# EasyEDA schematic Induction_motor_control.json
TITLE: Sheet_1; REV: 1.0; Date: 2024-01-03; Sheet: 1/1; Company: Your Company
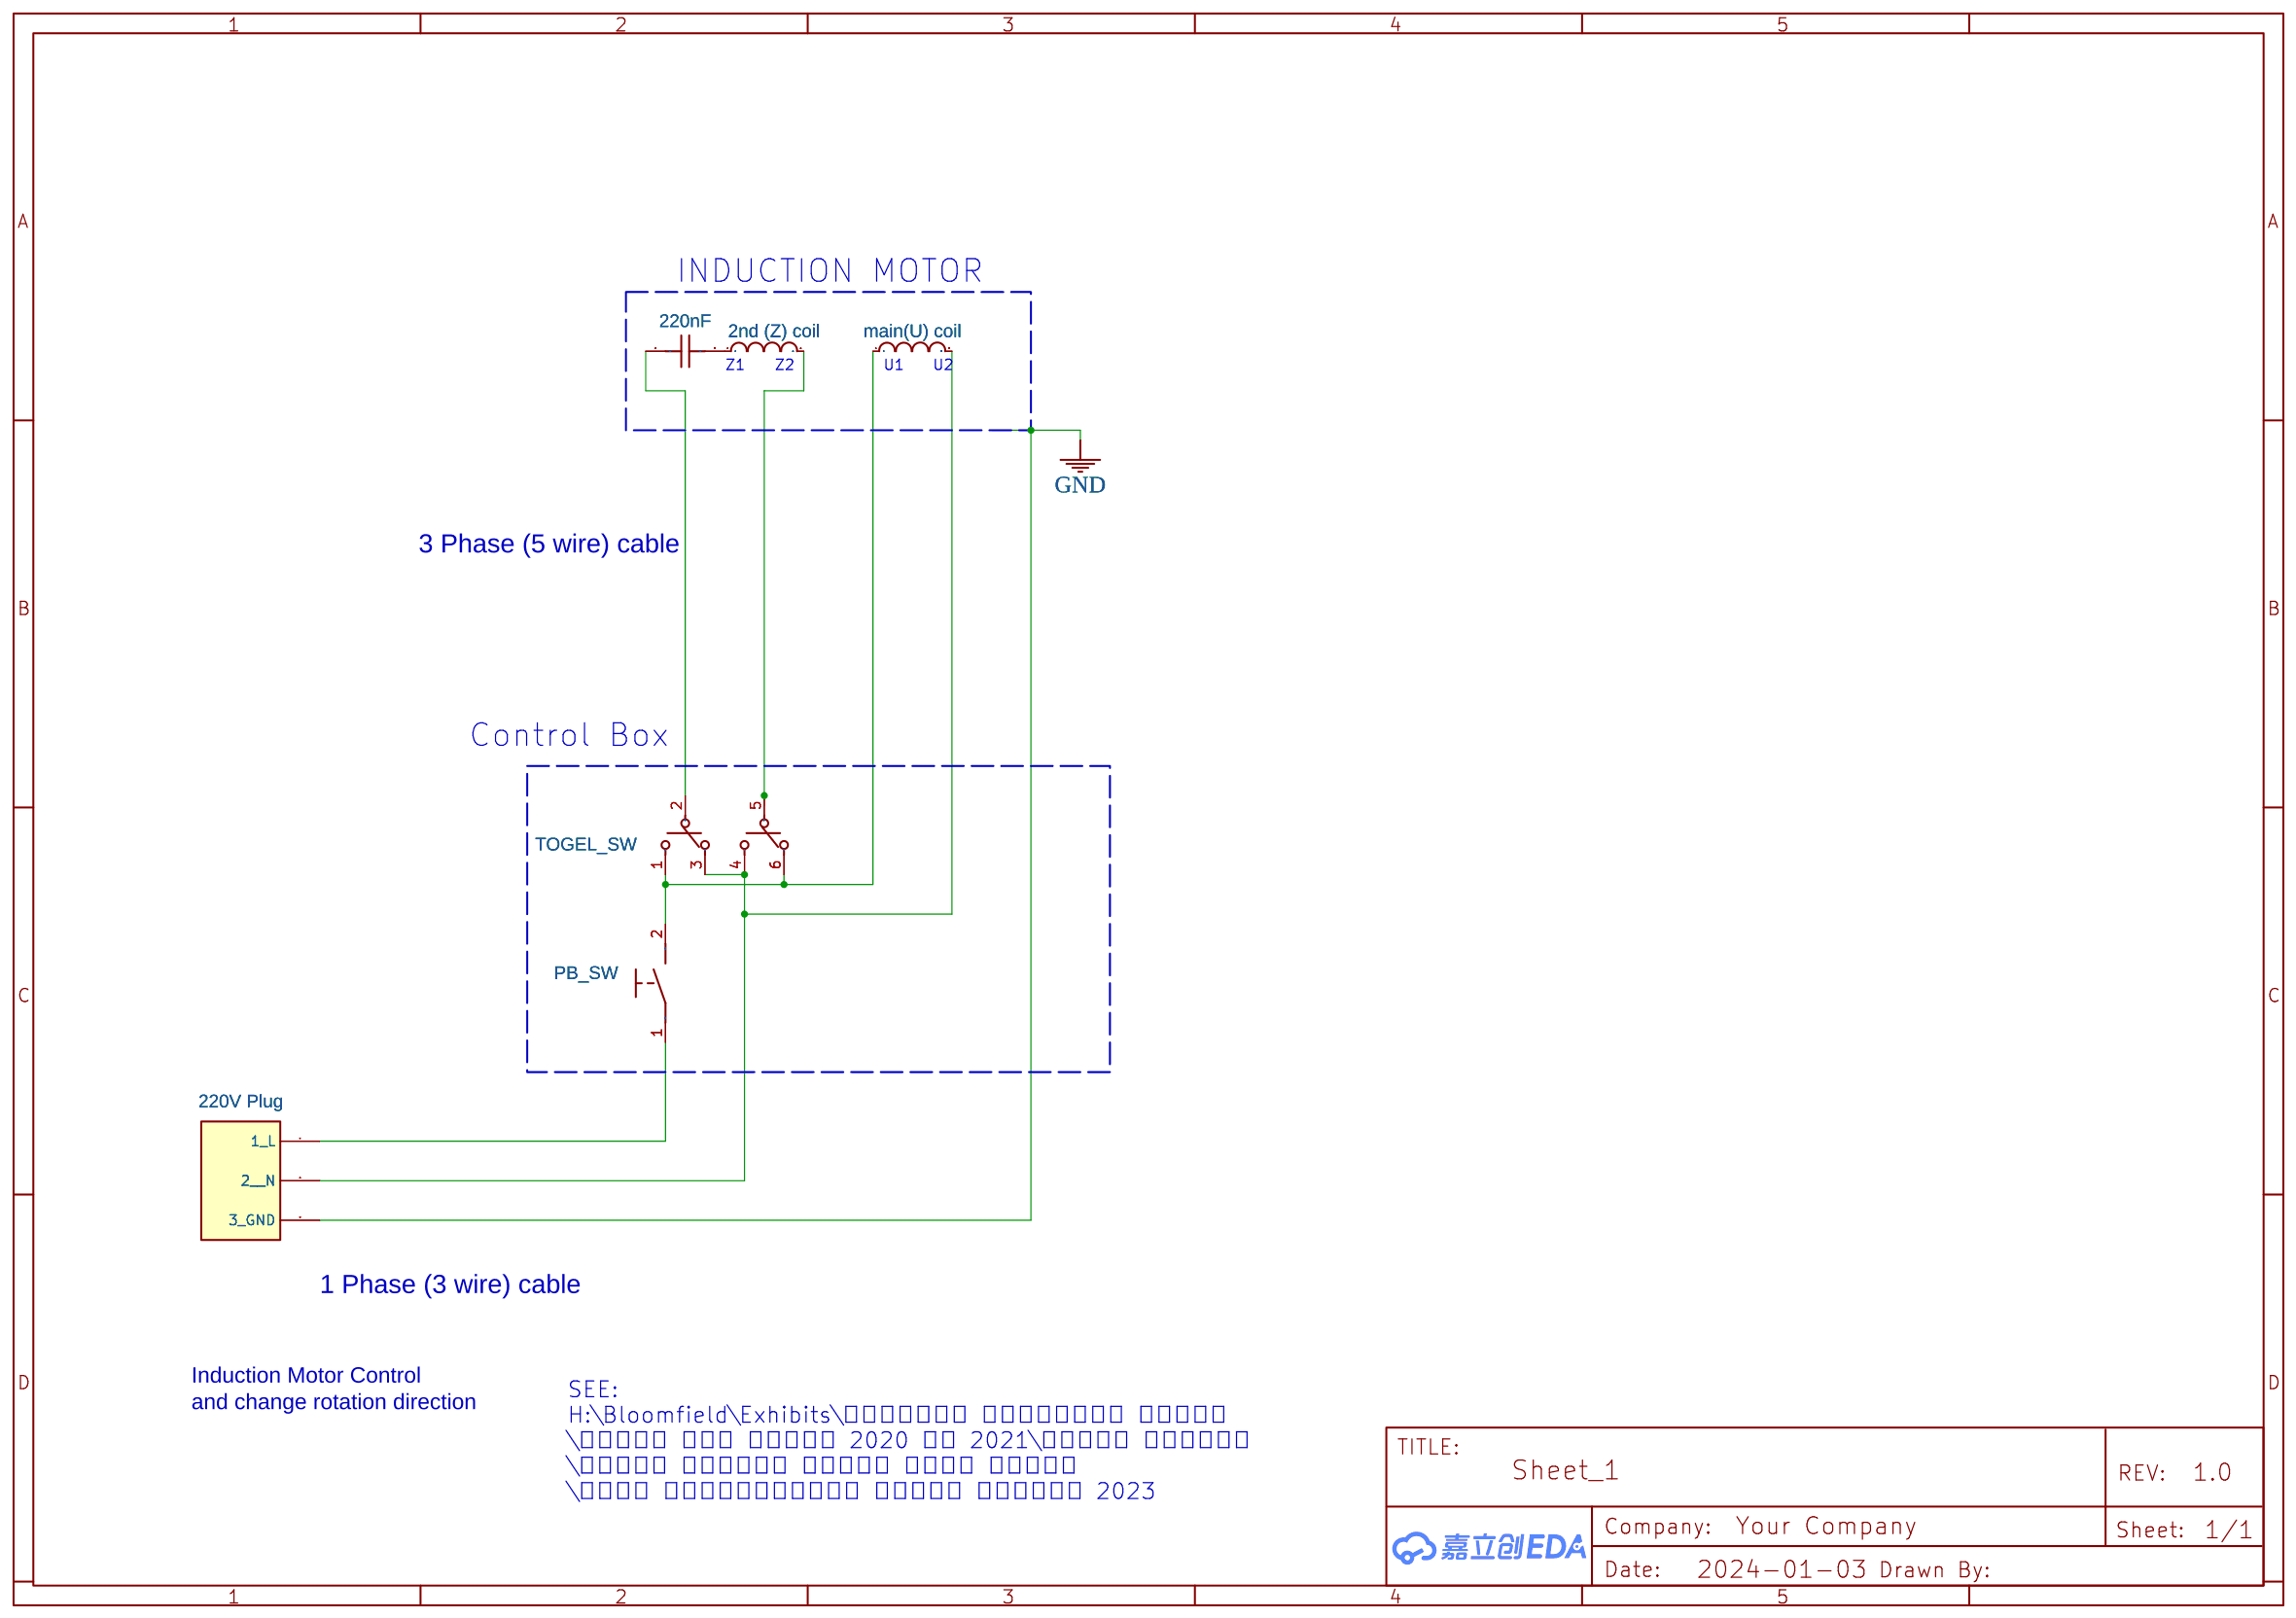
[diagram p0: schematic sheet]

## Parts
C1  220nF  [C0603]
L1  main(U) coil  [L0603]
L2  2nd (Z) coil  [L0603]
P1  220V Plug  [MAIN VOLTAGE PLUG 1]
PB_SW  K12C15N  [SW-TH_K12C15N]
SW3  TOGEL_SW  [SW-TH_2MD3T1B1M2QES-5]

## Library data of the parts
C1 = C_0603_US: Contributor: LCEDA_Lib; Package Display: No
L1 L2 = L0603_US: Contributor: LCEDA_Lib; Package Display: No
P1 = Main voltage: LCSC: C49661; Supplier Part: C49661; Supplier: LCSC; Manufacturer: LCSC; Package Display: No
PB_SW = K12C15N: Contributor: LCSC; Supplier: LCSC; Supplier Part: C221670; Manufacturer: C&K; JLCPCB Part Class: Extended Part; Package Display: No
SW3 = 2MD3T1B1M2QES-5: Contributor: LCSC; Supplier: LCSC; Supplier Part: C908283; Manufacturer: Dailywell(德利威); JLCPCB Part Class: Extended Part; Package Display: No

## Nets
GND: L1.2 P1.2(3 GND) SW3.3 SW3.4
Net-(C1-1): C1.1 SW3.2
Net-(C1-2): C1.2 L2.1
Net-(L1-1): L1.1 PB_SW.2 SW3.1 SW3.6
Net-(L2-2): L2.2 SW3.5
Net-(P1-1): P1.1(1 L) PB_SW.1

## Notes on the sheet
- INDUCTION MOTOR
- Z1
- Z2
- U1
- U2
- 3 Phase (5 wire) cable
- Control Box
- 1 Phase (3 wire) cable
- Induction Motor Control
  and change rotation direction
- SEE:
  H:\Bloomfield\Exhibits\רעיונות לתערוכות חדשות
  \הדפסה תלת ממדית 2020 או 2021\פיתוח מוצגים
  \חתכים שקופים אוריק מנוע סומפי
  \מנוע ואלקטרוניקה למוצג נובמבר 2023
